# Altium schematic sheet VHF_AMP_top.SchDoc: =MainTitle
size 420 x 297 mm; SheetNumber: 1; SheetTotal: 9; EDA_Number: ARTIQ; Projet: ARTIQ/SINARA; ModifiedBy: -; CreateDate: XX/XX/XXXX; CheckedDate: -; Title2: Top entity; DivGrp: ISE; Designer: shanasz
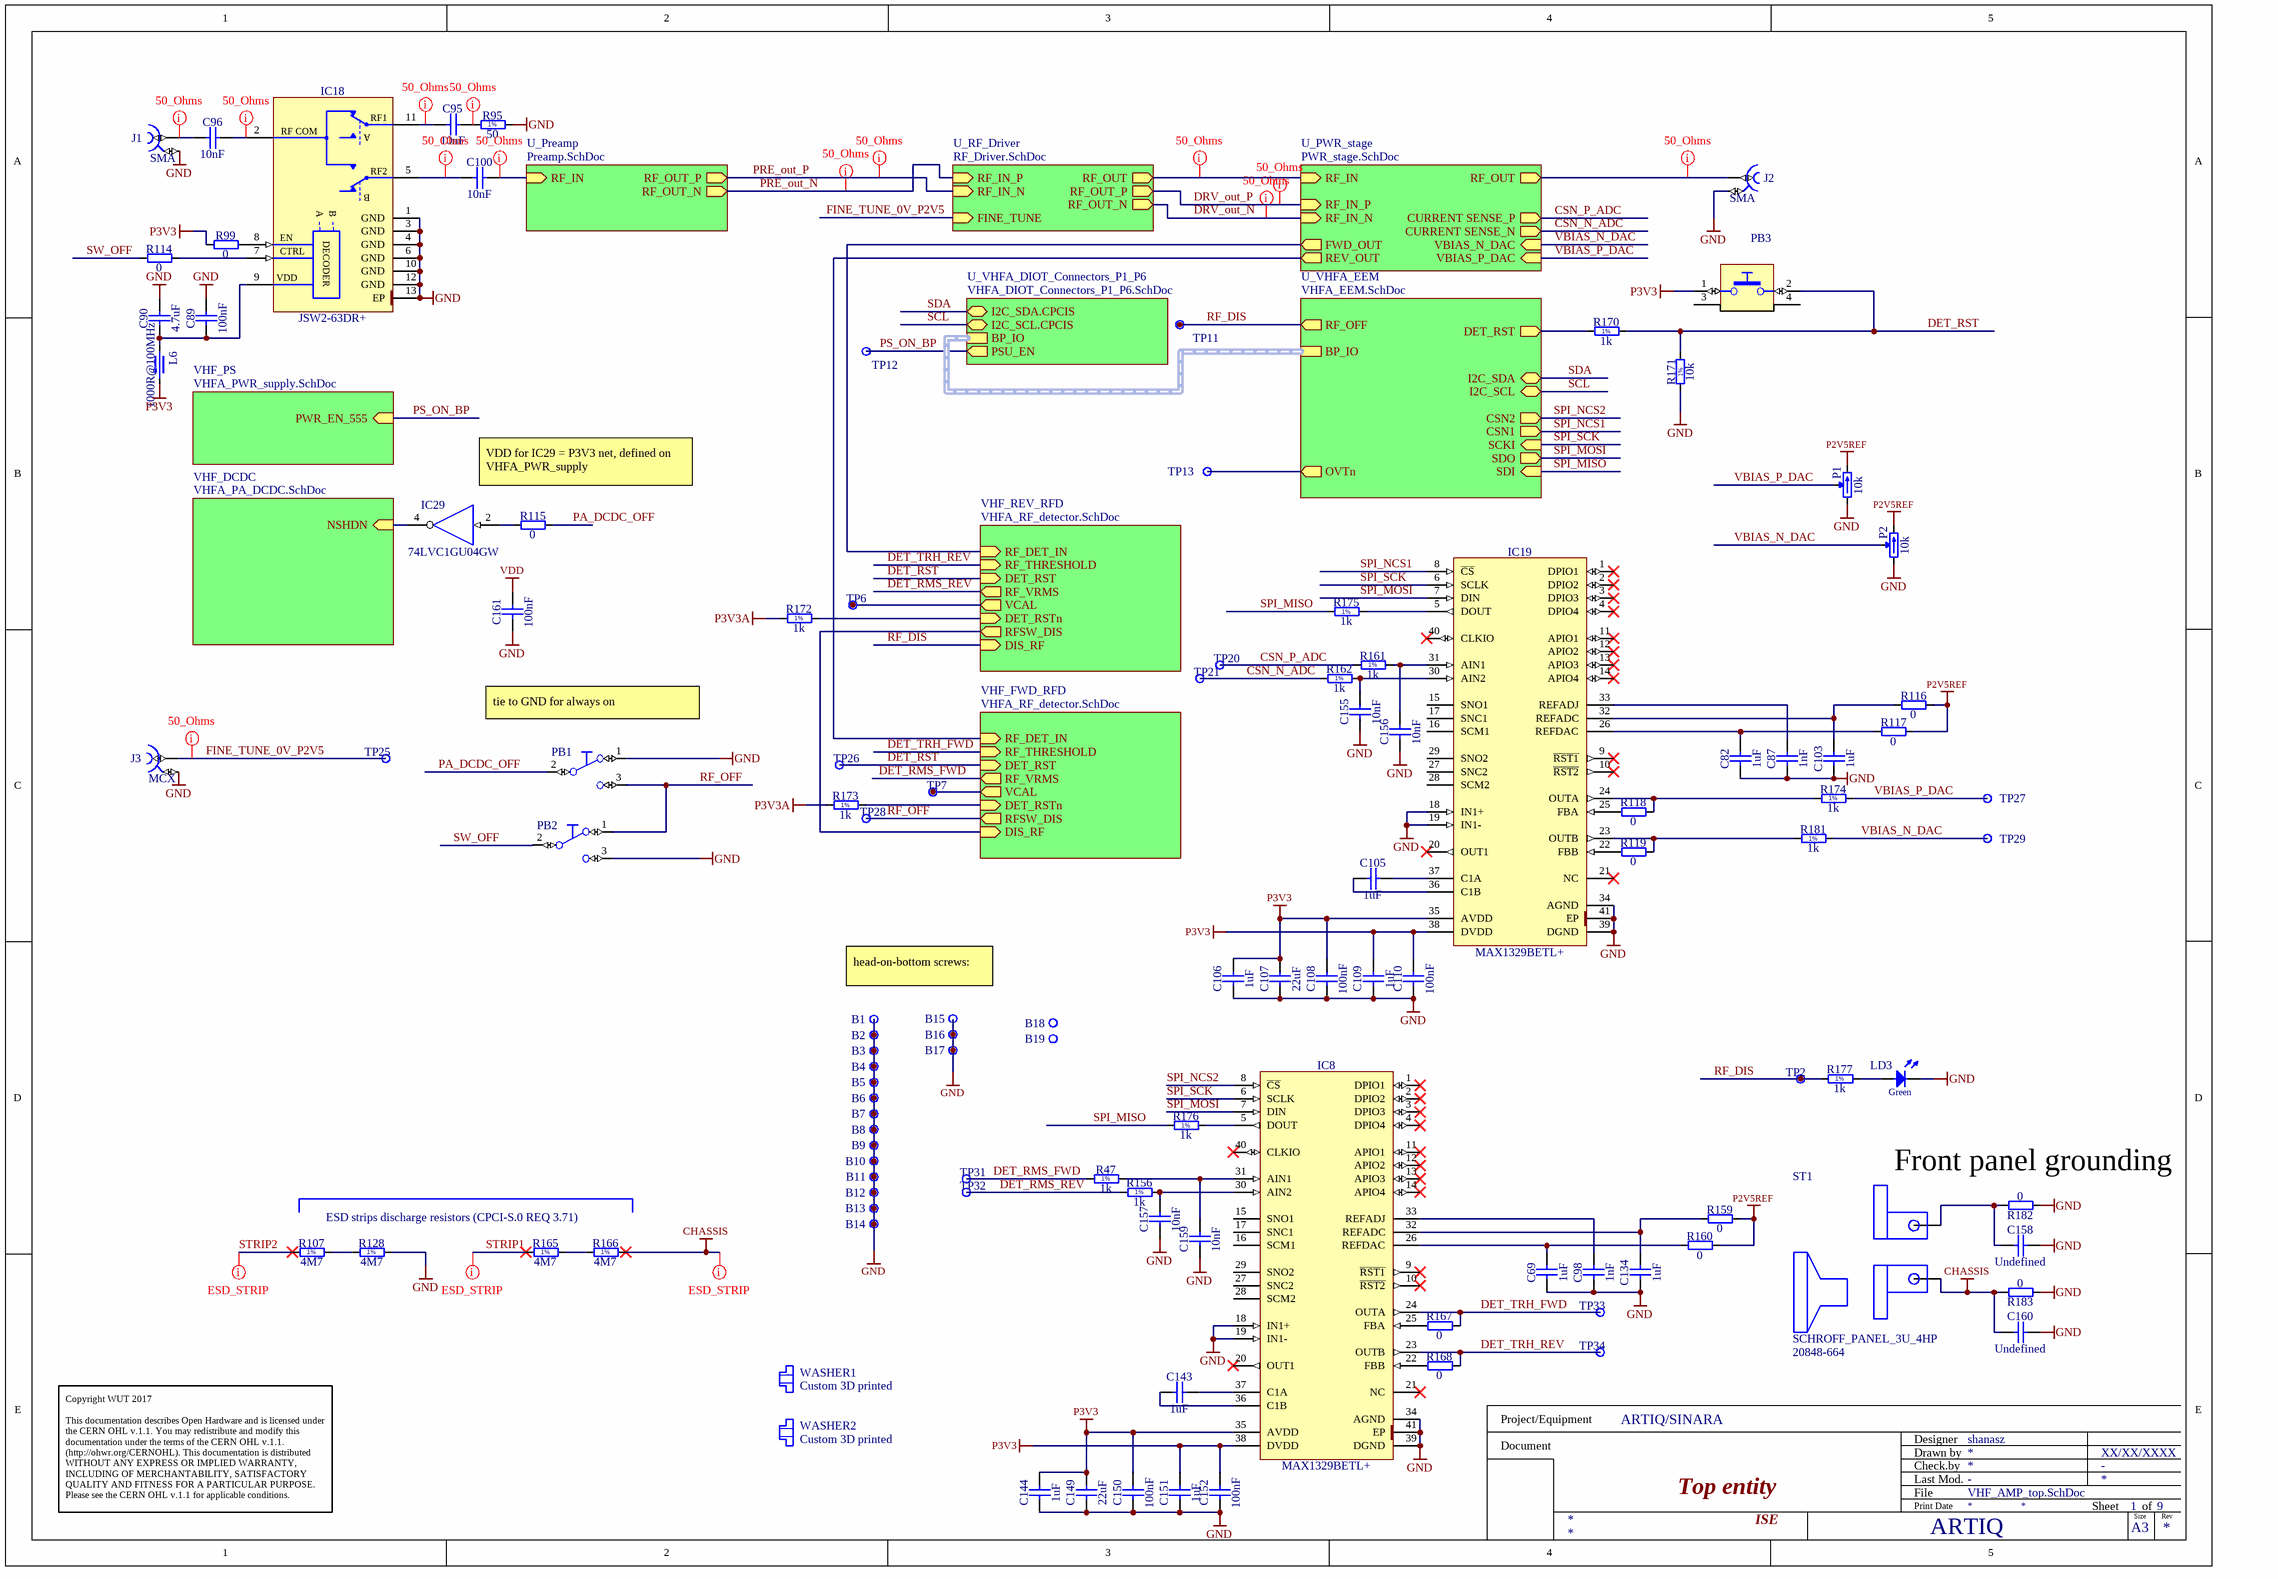
[diagram p0: VHF_AMP_top.SchDoc]

## Parts
B1  Plated Hole  [MTG320_550]  (value not drawn)  (no BOM)
B2  Plated Hole  [MTG320_550]  (value not drawn)  (no BOM)
B3  Plated Hole  [MTG320_550]  (value not drawn)  (no BOM)
B4  Plated Hole  [MTG320_550]  (value not drawn)  (no BOM)
B5  Plated Hole  [MTG320_550]  (value not drawn)  (no BOM)
B6  Plated Hole  [MTG320_550]  (value not drawn)  (no BOM)
B7  Plated Hole  [MTG320_550]  (value not drawn)  (no BOM)
B8  Plated Hole  [MTG320_550]  (value not drawn)  (no BOM)
B9  Plated Hole  [MTG320_550]  (value not drawn)  (no BOM)
B10  Plated Hole  [MTG320_550]  (value not drawn)  (no BOM)
B11  Plated Hole  [MTG320_550]  (value not drawn)  (no BOM)
B12  Plated Hole  [MTG320_550]  (value not drawn)  (no BOM)
B13  Plated Hole  [MTG320_550]  (value not drawn)  (no BOM)
B14  Plated Hole  [MTG320_550]  (value not drawn)  (no BOM)
B15  Plated Hole  [MTG320_550]  (value not drawn)  (no BOM)
B16  Plated Hole  [MTG320_550]  (value not drawn)  (no BOM)
B17  Plated Hole  [MTG320_550]  (value not drawn)  (no BOM)
B18  Plated Hole  [MTG320_550]  (value not drawn)  (no BOM)
B19  Plated Hole  [MTG320_550]  (value not drawn)  (no BOM)
C69  1uF  [CAPC1005X55N]
C82  1uF  [CAPC1005X55N]
C87  1nF  [CAPC2012X135N]
C89  100nF  [CAPC1005X55N]
C90  4.7uF  [CAPC1709X95N]
C95  10nF  [CAPC1608X87N]
C96  10nF  [CAPC1608X87N]
C98  1nF  [CAPC2012X135N]
C100  10nF  [CAPC1608X87N]
C103  1uF  [CAPC1005X55N]
C105  1uF  [CAPC1005X55N]
C106  1uF  [CAPC1005X55N]
C107  22uF  [CAPC3216X180N]
C108  100nF  [CAPC1005X55N]
C109  1uF  [CAPC1005X55N]
C110  100nF  [CAPC1005X55N]
C134  1uF  [CAPC1005X55N]
C143  1uF  [CAPC1005X55N]
C144  1uF  [CAPC1005X55N]
C149  22uF  [CAPC3216X180N]
C150  100nF  [CAPC1005X55N]
C151  1uF  [CAPC1005X55N]
C152  100nF  [CAPC1005X55N]
C155  10nF  [CAPC1608X87N]
C156  10nF  [CAPC1608X87N]
C157  10nF  [CAPC1608X87N]
C158  Undefined  [CAPC2012X135N]
C159  10nF  [CAPC1608X87N]
C160  Undefined  [CAPC2012X135N]
C161  100nF  [CAPC1005X55N]
IC8  MAX1329BETL+  [QFN50P600X600X80-41N-S425]
IC18  JSW2-63DR+  [MINI-CIRCUITS_MT1818]
IC19  MAX1329BETL+  [QFN50P600X600X80-41N-S425]
IC29  74LVC1GU04GW  [SOT65P212X110-5N]
J1  SMA  [DELOCK_65848]
J2  SMA  [DELOCK_65848]
J3  MCX  [AMPHENOL_919-383J-51A]
L6  1000R@100MHz  [INDC1608X95N]
LD3  Green  [LED_KINGBRIGHT_KPH-1608CGCK]
P1  10k  [TRIM_BOURNS_3224W]
P2  10k  [TRIM_BOURNS_3224W]
PB1  Switch  [SW_C&K_PCM12SMTR]  (value not drawn)
PB2  Switch  [SW_C&K_PCM12SMTR]  (value not drawn)
PB3  Push Button  [PB_TYCO_1-1825027-1]  (value not drawn)
R47  1k  [RESC1005X40N]
R95  50  [RESC1608X55N]
R99  0  [RESC1608X55N]
R107  4M7  [RESC2113X55N]
R114  0  [RESC1608X55N]
R115  0  [RESC1608X55N]
R116  0  [RESC1608X55N]
R117  0  [RESC1608X55N]
R118  0  [RESC1608X55N]
R119  0  [RESC1608X55N]
R128  4M7  [RESC2113X55N]
R156  1k  [RESC1005X40N]
R159  0  [RESC1608X55N]
R160  0  [RESC1608X55N]
R161  1k  [RESC1005X40N]
R162  1k  [RESC1005X40N]
R165  4M7  [RESC2113X55N]
R166  4M7  [RESC2113X55N]
R167  0  [RESC1608X55N]
R168  0  [RESC1608X55N]
R170  1k  [RESC1005X40N]
R171  10k  [RESC1005X40N]
R172  1k  [RESC1005X40N]
R173  1k  [RESC1005X40N]
R174  1k  [RESC1005X40N]
R175  1k  [RESC1005X40N]
R176  1k  [RESC1005X40N]
R177  1k  [RESC1005X40N]
R181  1k  [RESC1005X40N]
R182  0  [RESC1608X55N]
R183  0  [RESC1608X55N]
ST1  SCHROFF_PANEL_3U_4HP  Manufacturer Part Number 2: 20848-664  [SCHROFF_PANEL_3HP_4U]
TP2  Test Point  [TPS127]  (value not drawn)
TP6  Test Point  [TPS127]  (value not drawn)
TP7  Test Point  [TPS127]  (value not drawn)
TP11  Test Point  [TPS127]  (value not drawn)
TP12  Test Point  [TPS127]  (value not drawn)
TP13  Test Point  [NICOMATIC_C12000B]  (value not drawn)
TP20  Test Point  [TPS127]  (value not drawn)
TP21  Test Point  [TPS127]  (value not drawn)
TP25  Test Point  [TPS127]  (value not drawn)
TP26  Test Point  [TPS127]  (value not drawn)
TP27  Test Point  [TPS127]  (value not drawn)
TP28  Test Point  [TPS127]  (value not drawn)
TP29  Test Point  [TPS127]  (value not drawn)
TP31  Test Point  [TPS127]  (value not drawn)
TP32  Test Point  [TPS127]  (value not drawn)
TP33  Test Point  [TPS127]  (value not drawn)
TP34  Test Point  [TPS127]  (value not drawn)
WASHER1  Custom 3D printed  [Keystone_7687]
WASHER2  Custom 3D printed  [Keystone_7687]

## Sub-sheets
U_Preamp = Preamp.SchDoc: RF_IN (in), RF_OUT_N (out), RF_OUT_P (out)
U_PWR_stage = PWR_stage.SchDoc: RF_OUT (out), RF_IN (in), RF_IN_P (in), RF_IN_N (in), FWD_OUT (out), REV_OUT (out), CURRENT SENSE_P (out), CURRENT SENSE_N (out), VBIAS_N_DAC (in), VBIAS_P_DAC (in)
U_RF_Driver = RF_Driver.SchDoc: RF_OUT (out), RF_IN_P (in), RF_IN_N (in), RF_OUT_P (out), RF_OUT_N (out), FINE_TUNE (in)
U_VHFA_DIOT_Connectors_P1_P6 = VHFA_DIOT_Connectors_P1_P6.SchDoc: I2C_SDA.CPCIS (bidir), I2C_SCL.CPCIS (bidir), BP_IO (harness EEM_LVDS), PSU_EN (out)
U_VHFA_EEM = VHFA_EEM.SchDoc: I2C_SDA (bidir), I2C_SCL (bidir), OVTn (out), BP_IO (harness EEM_LVDS), RF_OFF (out), DET_RST (out), CSN1 (out), SCKI (in), SDO (out), SDI (in), CSN2 (out)
VHF_DCDC = VHFA_PA_DCDC.SchDoc: NSHDN (in)
VHF_FWD_RFD = VHFA_RF_detector.SchDoc: RF_DET_IN (in), RF_THRESHOLD (in), DET_RST (in), RF_VRMS (out), VCAL (out), DET_RSTn (in), RFSW_DIS (out), DIS_RF (in)
VHF_PS = VHFA_PWR_supply.SchDoc: PWR_EN_555 (in)
VHF_REV_RFD = VHFA_RF_detector.SchDoc: RF_DET_IN (in), RF_THRESHOLD (in), DET_RST (in), RF_VRMS (out), VCAL (out), DET_RSTn (in), RFSW_DIS (out), DIS_RF (in)

## Nets
CHASSIS: C160.1 R166.2 R183.2 ST1.0
GND: B1.1 B2.1 B3.1 B4.1 B5.1 B6.1 B7.1 B8.1 B9.1 B10.1 B11.1 B12.1 B13.1 B14.1 B16.1 B17.1 C69.1 C82.1 C87.1 C89.1 C90.1 C98.1 C103.1 C106.1 C107.1 C108.1 C109.1 C110.1 C134.1 C144.1 C149.1 C150.1 C151.1 C152.1 C155.1 C156.1 C157.1 C158.2 C159.1 C160.2 C161.1 IC8.18(IN1+) IC8.19(IN1-) IC8.34(AGND) IC8.39(DGND) IC8.41(EP) IC18.1(GND) IC18.3(GND) IC18.4(GND) IC18.6(GND) IC18.10(GND) IC18.12(GND) IC18.13(EP) IC19.18(IN1+) IC19.19(IN1-) IC19.34(AGND) IC19.39(DGND) IC19.41(EP) IC29.3(GND) J1.2 J2.2 J3.2 LD3.1(C) P1.1(CCW) P2.1(CCW) PB1.1 PB2.3 R95.2 R128.2 R171.1 R182.1 R183.1
P2V5REF: P1.3(CW) P2.3(CW) R116.2 R117.2 R159.2 R160.2
P3V3: C106.2 C107.2 C108.2 C109.2 C110.2 C144.2 C149.2 C150.2 C151.2 C152.2 IC8.35(AVDD) IC8.38(DVDD) IC19.35(AVDD) IC19.38(DVDD) L6.2 PB3.1 R99.1
P3V3A: R172.1 R173.1
VDD: C161.2 IC29.5(VCC)
CSN_N_ADC: R162.1 TP21.1 ; sheet U_PWR_stage/CURRENT SENSE_N
CSN_P_ADC: R161.1 TP20.1 ; sheet U_PWR_stage/CURRENT SENSE_P
DET_RMS_FWD: R47.1 TP31.1 ; sheet VHF_FWD_RFD/RF_VRMS
DET_RMS_REV: R156.1 TP32.1 ; sheet VHF_REV_RFD/RF_VRMS
DET_RST: PB3.2 R170.2 R171.2 TP26.1 ; sheet VHF_REV_RFD/DET_RST, sheet VHF_FWD_RFD/DET_RST
DET_TRH_FWD: IC8.24(OUTA) R167.2 TP33.1 ; sheet VHF_FWD_RFD/RF_THRESHOLD
DET_TRH_REV: IC8.23(OUTB) R168.2 TP34.1 ; sheet VHF_REV_RFD/RF_THRESHOLD
DRV_out_N: sheet U_PWR_stage/RF_IN_N, sheet U_RF_Driver/RF_OUT_N
DRV_out_P: sheet U_PWR_stage/RF_IN_P, sheet U_RF_Driver/RF_OUT_P
FINE_TUNE_0V_P2V5: J3.1 TP25.1 ; sheet U_RF_Driver/FINE_TUNE
PA_DCDC_OFF: PB1.2 R115.2
PRE_out_N: sheet U_Preamp/RF_OUT_N, sheet U_RF_Driver/RF_IN_P
PRE_out_P: sheet U_Preamp/RF_OUT_P, sheet U_RF_Driver/RF_IN_N
PS_ON_BP: TP12.1 ; sheet U_VHFA_DIOT_Connectors_P1_P6/PSU_EN, sheet VHF_PS/PWR_EN_555
RF_DIS: R177.1 TP2.1 TP11.1 ; sheet U_VHFA_EEM/RF_OFF, sheet VHF_REV_RFD/DIS_RF
RF_OFF: PB1.3 PB2.1 TP28.1 ; sheet VHF_FWD_RFD/RFSW_DIS
SCL: sheet U_VHFA_DIOT_Connectors_P1_P6/I2C_SCL.CPCIS, sheet U_VHFA_EEM/I2C_SCL
SDA: sheet U_VHFA_DIOT_Connectors_P1_P6/I2C_SDA.CPCIS, sheet U_VHFA_EEM/I2C_SDA
SPI_MISO: R175.1 R176.1 ; sheet U_VHFA_EEM/SDI
SPI_MOSI: IC8.7(DIN) IC19.7(DIN) ; sheet U_VHFA_EEM/SDO
SPI_NCS1: IC19.8(~{CS}) ; sheet U_VHFA_EEM/CSN1
SPI_NCS2: IC8.8(~{CS}) ; sheet U_VHFA_EEM/CSN2
SPI_SCK: IC8.6(SCLK) IC19.6(SCLK) ; sheet U_VHFA_EEM/SCKI
STRIP1: R165.1
STRIP2: R107.1
SW_OFF: PB2.2 R114.1
VBIAS_N_DAC: P2.2(W) R181.2 TP29.1 ; sheet U_PWR_stage/VBIAS_N_DAC
VBIAS_P_DAC: P1.2(W) R174.2 TP27.1 ; sheet U_PWR_stage/VBIAS_P_DAC
NetC69_2: C69.2 IC8.26(REFDAC) R160.1
NetC82_2: C82.2 IC19.26(REFDAC) R117.1
NetC87_2: C87.2 IC19.33(REFADJ)
NetC89_2: C89.2 C90.2 IC18.9(VDD) L6.1
NetC95_1: C95.1 IC18.11(RF1)
NetC95_2: C95.2 R95.1
NetC96_1: C96.1 J1.1
NetC96_2: C96.2 IC18.2(RF_COM)
NetC98_2: C98.2 IC8.33(REFADJ)
NetC100_1: C100.1 IC18.5(RF2)
NetC100_2: C100.2 ; sheet U_Preamp/RF_IN
NetC103_2: C103.2 IC19.32(REFADC) R116.1
NetC105_1: C105.1 IC19.36(C1B)
NetC105_2: C105.2 IC19.37(C1A)
NetC134_2: C134.2 IC8.32(REFADC) R159.1
NetC143_1: C143.1 IC8.36(C1B)
NetC143_2: C143.2 IC8.37(C1A)
NetC155_2: C155.2 IC19.30(AIN2) R162.2
NetC156_2: C156.2 IC19.31(AIN1) R161.2
NetC157_2: C157.2 IC8.30(AIN2) R156.2
NetC158_1: C158.1 R182.2 ST1.1
NetC159_2: C159.2 IC8.31(AIN1) R47.2
NetIC8_5: IC8.5(DOUT) R176.2
NetIC8_22: IC8.22(FBB) R168.1
NetIC8_25: IC8.25(FBA) R167.1
NetIC18_7: IC18.7(CTRL) R114.2
NetIC18_8: IC18.8(EN) R99.2
NetIC19_5: IC19.5(DOUT) R175.2
NetIC19_22: IC19.22(FBB) R119.1
NetIC19_23: IC19.23(OUTB) R119.2 R181.1
NetIC19_24: IC19.24(OUTA) R118.2 R174.1
NetIC19_25: IC19.25(FBA) R118.1
NetIC29_2: IC29.2(IN) R115.1
NetIC29_4: IC29.4(OUT) ; sheet VHF_DCDC/NSHDN
NetJ2_1: J2.1 ; sheet U_PWR_stage/RF_OUT
NetLD3_2: LD3.2(A) R177.2
NetR107_2: R107.2 R128.1
NetR165_2: R165.2 R166.1
NetR170_1: R170.1 ; sheet U_VHFA_EEM/DET_RST
NetR172_2: R172.2 ; sheet VHF_REV_RFD/DET_RSTn
NetR173_2: R173.2 ; sheet VHF_FWD_RFD/DET_RSTn
NetTP6_1: TP6.1 ; sheet VHF_REV_RFD/VCAL
NetTP7_1: TP7.1 ; sheet VHF_FWD_RFD/VCAL
NetTP13_1: TP13.1 ; sheet U_VHFA_EEM/OVTn
(unnamed): sheet U_PWR_stage/RF_IN, sheet U_RF_Driver/RF_OUT
(unnamed): sheet U_PWR_stage/FWD_OUT, sheet VHF_REV_RFD/RF_DET_IN
(unnamed): sheet U_PWR_stage/REV_OUT, sheet VHF_FWD_RFD/RF_DET_IN
(unnamed): sheet VHF_REV_RFD/RFSW_DIS, sheet VHF_FWD_RFD/DIS_RF

Not connected (* = marked no-connect by the designer): B15 1; B18 1; B19 1; IC8 1(DPIO1)* 2(DPIO2)* 3(DPIO3)* 4(DPIO4)* 9(~{RST1})* 10(~{RST2})* 11(APIO1)* 12(APIO2)* 13(APIO3)* 14(APIO4)* 15(SNO1) 16(SCM1) 17(SNC1) 20(OUT1)* 21(NC)* 27(SNC2) 28(SCM2) 29(SNO2) 40(CLKIO)*; IC19 1(DPIO1)* 2(DPIO2)* 3(DPIO3)* 4(DPIO4)* 9(~{RST1})* 10(~{RST2})* 11(APIO1)* 12(APIO2)* 13(APIO3)* 14(APIO4)* 15(SNO1) 16(SCM1) 17(SNC1) 20(OUT1)* 21(NC)* 27(SNC2) 28(SCM2) 29(SNO2) 40(CLKIO)*; PB3 3 4

## Buses and harness runs
harness sheet U_VHFA_DIOT_Connectors_P1_P6/BP_IO = sheet U_VHFA_EEM/BP_IO

## Layout directives
net class 50_Ohms: (no net found under the mark), DRV_out_N, DRV_out_P, FINE_TUNE_0V_P2V5, NetC95_1, NetC95_2, NetC96_1, NetC96_2, NetC100_1, NetC100_2, NetJ2_1, PRE_out_N, PRE_out_P
net class ESD_STRIP: CHASSIS, STRIP1, STRIP2

## Notes on the sheet
- VDD for IC29 = P3V3 net, defined on VHFA_PWR_supply
- (near PB1) tie to GND for always on
- head-on-bottom screws:
- (near R182) Front panel grounding
- ESD strips discharge resistors (CPCI-S.0 REQ 3.71)
- Project/Equipment
- Document
- Designer
- Drawn by
- Check.by
- Copyright WUT 2017
  This documentation describes Open Hardware and is licensed under the CERN OHL v.1.1. You may redistribute and modify this documentation under the terms of the CERN OHL v.1.1. (http://ohwr.org/CERNOHL). This documentation is distributed WITHOUT ANY EXPRESS OR IMPLIED WARRANTY, INCLUDING OF MERCHANTABILITY, SATISFACTORY QUALITY AND FITNESS FOR A PARTICULAR PURPOSE. Please see the CERN OHL v.1.1 for applicable conditions.
- File
- Last Mod.
- Print Date
- Sheet
- Size
- A3
- of
- Rev
- (in symbol JSW2-63DR+) A; B; DECODER
- (in symbol R0402_1K_1%_0.0625W_100PPM) 1%
- (in symbol R0402_10K_1%_0.0625W_100PPM) 1%
- (in symbol R0603_50R_1%_0.1W_100PPM) 1%
- (in symbol R0805_4M7_1%_0.125W_100PPM_VISHAY_CRCW e3) 1%

## Library data of the parts
B1-B19 = PLATED_HOLE3.2_PAD5.5: Single Terminal Socket; Part Description: Plated Through Hole: Hole Dia.=3.2mm Pad Dia.=5.5mm; Mounted: No; Part Number: PLATED_HOLE3.2_PAD5.5; Component Type: Standard (No BOM); Pin Count: 1; Family: Plated Hole; Socket: No; SMD: No; Sense: No; Status: None; ComponentHeight: 0mm; HelpURL: Undefined; Author: CERN DEM JMW; CreateDate: 01.10.2012; LatestRevisionDate: 01.10.2012; PackageDescription: Plated Through Hole: Hole Dia.=3.2mm Pad Dia.=5.5mm
C69 C82 C103 C105 C106 C109 C134 C143 C144 C151 = CC0402_1UF_16V_10%_X5R: Non-polarised capacitor; Part Description: SMD Multilayer Chip Ceramic Capacitor; Manufacturer: GENERIC; Manufacturer1 Part Number: C1005X5R1C105KT; Voltage: 16V; TC: X5R; Tolerance: ±10%; Part Number: CC0402_1UF_16V_10%_X5R; Component Kind: Standard; Component Type: Standard; Pin Count: 2; Value: 1uF; Status: Preferred; Manufacturer Part Number: CC0402_1UF_16V_10%_X5R; Case: 0402; Mounted: Yes; Socket: No; SMD: Yes; Sense: No; Manufacturer1 Example: TDK; Manufacturer1 ComponentHeight: 0.55mm; HelpURL: \\cern.ch\dfs\Applications\Altium\Datasheets\CC0402_X5R_TDK_C.pdf; Author: CERN DEM JLC; CreateDate: 2012-10-25; LatestRevisionDate: 2012-10-25
C87 C98 = CC0805_1NF_50V_5%_C0G: Non-polarised capacitor; Part Description: SMD Multilayer Chip Ceramic Capacitor; Manufacturer: GENERIC; Manufacturer1 Part Number: C0805C102J5GACTU; Voltage: 50V; TC: C0G/NP0; Tolerance: ±5%; Part Number: CC0805_1NF_50V_5%_C0G; Component Kind: Standard; Component Type: Standard; Pin Count: 2; Value: 1nF; Status: None; Manufacturer Part Number: CC0805_1NF_50V_5%_C0G; Case: 0805; Mounted: Yes; Socket: No; SMD: Yes; Sense: No; Manufacturer1 Example: KEMET; Manufacturer1 ComponentHeight: 0.88mm; HelpURL: \\cern.ch\dfs\Applications\Altium\Datasheets\CC0805_C0G_KEMET_(Commercial Grade).pdf; Author: CERN DEM JLC; CreateDate: 02.02.2011; LatestRevisionDate: 22.04.2015
C89 = CC0402_100NF_16V_10%_X5R: Non-polarised capacitor; Manufacturer: GENERIC; Part Description: SMD Multilayer Chip Ceramic Capacitor; Manufacturer1 Part Number: GRM155R61C104KA88D; Voltage: 16V; TC: X5R; Tolerance: ±10%; Value: 100nF; Manufacturer Part Number: CC0402_100NF_16V_10%_X5R; Part Number: CC0402_100NF_16V_10%_X5R; Component Kind: Standard; Component Type: Standard; Pin Count: 2; Status: None; Case: 0402; Mounted: Yes; Socket: No; SMD: Yes; Sense: No; Manufacturer1 Example: MURATA; Manufacturer1 ComponentHeight: 0.55mm; HelpURL: \\cern.ch\dfs\Applications\Altium\Datasheets\CC0402_X5R_MURATA_GRM.pdf; Author: CERN DEM JLC; CreateDate: 10.12.2013; LatestRevisionDate: 10.12.2013
C90 = CC0603_4.7UF_16V_10%_X5R: Non-polarised capacitor; Manufacturer: GENERIC; Part Description: SMD Multilayer Chip Ceramic Capacitor; Manufacturer1 Part Number: EMK107ABJ475KA-T; Voltage: 16V; TC: X5R; Tolerance: ±10%; Value: 4.7uF; Manufacturer Part Number: CC0603_4.7UF_16V_10%_X5R; Part Number: CC0603_4.7UF_16V_10%_X5R; Component Kind: Standard; Component Type: Standard; Pin Count: 2; Status: None; Case: 0603; Mounted: Yes; Socket: No; SMD: Yes; Sense: No; Manufacturer1 Example: TAIYO YUDEN; Manufacturer1 ComponentHeight: 0.95mm; HelpURL: \\cern.ch\dfs\Applications\Altium\Datasheets\CC0603_X7R_TAIYO-YUDEN_HIGH-VALUE.pdf; Author: CERN DEM JLC; CreateDate: 16.12.2013; LatestRevisionDate: 16.09.2014
C95 C96 C100 C155-C157 C159 = CC0603_10NF_50V_10%_X7R: Non-polarised capacitor; Part Description: SMD Multilayer Chip Ceramic Capacitor; Manufacturer: GENERIC; Manufacturer1 Part Number: 223858615636; Voltage: 50V; TC: X7R; Tolerance: ±10%; Part Number: CC0603_10NF_50V_10%_X7R; Component Kind: Standard; Component Type: Standard; Pin Count: 2; Value: 10nF; Status: Preferred; Manufacturer Part Number: CC0603_10NF_50V_10%_X7R; Case: 0603; Mounted: Yes; Socket: No; SMD: Yes; Sense: No; Manufacturer1 Example: PHYCOMP; Manufacturer1 ComponentHeight: 0.87mm; HelpURL: \\cern.ch\dfs\Applications\Altium\Datasheets\CC0603_X7R_PHYCOMP.pdf; Author: CERN DEM JLC; CreateDate: 03.12.2007; LatestRevisionDate: 03.12.2007
C107 C149 = CC1206_22UF_35V_20%_JB_TDK_C3216JB1V226M160AC: Non-polarised capacitor; Part Description: SMD Multilayer Chip Ceramic Capacitor; Manufacturer: TDK; Voltage: 35V; TC: JB(±10%); Tolerance: ±20%; Part Number: CC1206_22UF_35V_20%_JB_TDK_C3216JB1V226M160AC; Component Kind: Standard; Component Type: Standard; Pin Count: 2; Value: 22uF; Status: None; Manufacturer Part Number: C3216JB1V226M160AC; Case: 1206; Mounted: Yes; Socket: No; SMD: Yes; Sense: No; HelpURL: \\cern.ch\dfs\Applications\Altium\Datasheets\CC1206_TDK_C3216JB1V226M160AC.pdf; Author: CERN DEM JLC; CreateDate: 13.07.2017; LatestRevisionDate: 13.07.2017; ComponentHeight: 1.8mm
C108 C110 C150 C152 C161 = CC0402_100NF_16V_10%_X5R: Non-polarised capacitor; Part Description: SMD Multilayer Chip Ceramic Capacitor; Manufacturer: GENERIC; Manufacturer1 Part Number: GRM155R61C104KA88D; Voltage: 16V; TC: X5R; Tolerance: ±10%; Part Number: CC0402_100NF_16V_10%_X5R; Component Kind: Standard; Component Type: Standard; Pin Count: 2; Value: 100nF; Status: None; Manufacturer Part Number: CC0402_100NF_16V_10%_X5R; Case: 0402; Mounted: Yes; Socket: No; SMD: Yes; Sense: No; Manufacturer1 Example: MURATA; Manufacturer1 ComponentHeight: 0.55mm; HelpURL: \\cern.ch\dfs\Applications\Altium\Datasheets\CC0402_X5R_MURATA_GRM.pdf; Author: CERN DEM JLC; CreateDate: 10.12.2013; LatestRevisionDate: 10.12.2013
C158 C160 = CC0805_NO-VALUE: Non-polarised capacitor; Part Description: Reserved Footprint For 0805(2012) Chip Ceramic Capacitor; Mounted: No; Part Number: CC0805_NO-VALUE; Component Kind: Standard; Component Type: Standard; Pin Count: 2; Value: Undefined; Status: None; Manufacturer: Undefined; Manufacturer Part Number: CC0805_NO-VALUE; Case: 0805; Socket: No; SMD: Yes; Sense: No; Manufacturer1 ComponentHeight: 1.35mm; HelpURL: Undefined; Author: CERN DEM JLC; CreateDate: 10.12.2008; LatestRevisionDate: 11.09.2013
IC8 IC19 = MAX1329BETL+: 12-/16-Bit DAS with ADC, DACs, DPIOs, APIOs, Reference, Voltage Monitors, and Temp Sensor; Manufacturer: MAXIM; PressFit: No; Bonding: No; Part Number: MAX1329BETL+; Component Kind: Standard; Component Type: Standard; Device: MAX1329BETL+; PackageDescription: QFN, 0.50mm Pitch, Square; 40 Pin, 6.00mm L X 6.00mm W X 0.80mm H body (w/Thermal Tab 4.25 X 4.25mm), IPC Medium Density; Part Description: 12-/16-Bit DAS with ADC, DACs, DPIOs, APIOs, Reference, Voltage Monitors, and Temp Sensor; Manufacturer Part Number: MAX1329BETL; Pin Count: 41; Case: QFN40; Mounted: Yes; Socket: No; SMD: Yes; Sense: No; ComponentHeight: 0.8mm; Author: CERN DEM HF; HelpURL: \\cern.ch\dfs\Applications\Altium\Datasheets\MAX1329BETL+.pdf; CreateDate: 09.02.2022; LatestRevisionDate: 04.04.2022
IC18 = JSW2-63DR+: SPDT RF Switch, 50 Ohm, 5 to 6000MHz, High Power 3W; Part Description: SPDT RF Switch, 50 Ohms, 5 to 6000MHz, High Power 3W; Manufacturer: MINI-CIRCUITS; PressFit: No; Bonding: No; Part Number: JSW2-63DR+; Component Kind: Standard; Component Type: Standard; Device: JSW2-63DR+; PackageDescription: MINI-CIRCUITS MT1818 Case, Body 2.06mm L X 2.06mm W X 0.61mm H; Manufacturer Part Number: JSW2-63DR+; Pin Count: 13; Mounted: Yes; Socket: No; SMD: Yes; Sense: No; ComponentHeight: 0.61mm; Author: CERN DEM JMW; HelpURL: \\cern.ch\dfs\Applications\Altium\Datasheets\JSW2-63DR+.pdf; CreateDate: 11.08.2016; LatestRevisionDate: 11.08.2016
IC29 = 74LVC1GU04GW: Single Inverter Buffer; Manufacturer: NXP SEMICONDUCTORS; PressFit: No; Bonding: No; Part Number: 74LVC1GU04GW; Component Kind: Standard; Component Type: Standard; Device: 74LVC1GU04GW; PackageDescription: SOT353, SOT, 0.65mm Pitch, 5 pin, 1.25mm W X 2.05mm L X 1.10mm H, IPC Medium Density; Part Description: Inverter; Manufacturer Part Number: 74LVC1GU04GW; Pin Count: 3; Case: SOT353; Mounted: Yes; Socket: No; SMD: Yes; Sense: No; ComponentHeight: 1.1mm; Author: CERN DEM JLC; HelpURL: \\cern.ch\dfs\Applications\Altium\Datasheets\74LVC1GU04GW.pdf; CreateDate: 11.01.2011; LatestRevisionDate: 11.01.2011
J1 J2 = CON_SMA_DELOCK_65848: 50 Ohm Through Hole SMA Right Angle PCB Jack; Manufacturer: DELOCK; Manufacturer Part Number: 5848 (4043619658480); PressFit: No; Part Number: DELOCK_65848; Component Kind: Standard; Component Type: Standard; Pin Count: 5; Family: SMA; Mounted: Yes; Socket: No; SMD: No; Sense: No; Status: None; Part Description: 50 Ohm Through Hole SMA Right Angle PCB Jack; ComponentHeight: 12.5; HelpURL: \\cern.ch\dfs\Applications\Altium\Datasheets\AMPHENOL_132203-16.pdf; Author: GK; CreateDate: 13.05.2019; LatestRevisionDate: 13.05.2019
J3 = AMPHENOL_919-383J-51A: Part Description: 50 Ohm, RF Connector, MCX Right Angle PCB Receptacle Jack; PressFit: No; Part Number: AMPHENOL_919-383J-51A; Component Kind: Standard; Component Type: Standard; Pin Count: 5; Family: MCX; Mounted: Yes; Socket: No; SMD: No; Sense: No; Status: None; Manufacturer: AMPHENOL; Manufacturer Part Number: 919-383J-51A; ComponentHeight: 6mm; HelpURL: \\cern.ch\dfs\Applications\Altium\Datasheets\AMPHENOL_919-383J-51A.pdf; Author: CERN DEM BC; CreateDate: 31.01.2019; LatestRevisionDate: 31.01.2019
L6 = IND0603_MURATA_BLM18HE102SN1: Manufacturer: MURATA; Part Description: SMD EMIFIL Suppression Chip Ferrite Bead; Power: 600mA; Resistance: 0.35R; Tolerance: ±25%; Value: 1000R@100MHz; Manufacturer Part Number: BLM18HE102SN1; Part Number: IND0603_MURATA_BLM18HE102SN1; Component Kind: Standard; Component Type: Standard; Pin Count: 2; Status: None; Case: 0603; Mounted: Yes; Socket: No; SMD: Yes; Sense: No; ComponentHeight: 0.95mm; HelpURL: \\cern.ch\dfs\Applications\Altium\Datasheets\IND0603_MURATA_BLM18H.pdf; Author: CERN DEM JLC; CreateDate: 09.12.2013; LatestRevisionDate: 25.10.2018
LD3 = LED_KINGBRIGHT_KPH-1608CGCK: LED Green 1C 2A; Part Description: SMD Green LED, Case 1.6mmX0.8mm(0603), 0.65mm Thickness; PressFit: No; Bonding: No; Part Number: LED_KINGBRIGHT_KPH-1608CGCK; Component Kind: Standard; Component Type: Standard; Color: Green; PackageDescription: SMT Green LED, Case 0603, Body L 1.6 x W 0.8mm H 0.65mm; Manufacturer: KINGBRIGHT; Manufacturer Part Number: KPH-1608CGCK; Pin Count: 2; Mounted: Yes; Socket: No; SMD: Yes; Sense: No; ComponentHeight: 0.65mm; HelpURL: \\cern.ch\dfs\Applications\Altium\Datasheets\LED_KINGBRIGHT_KPH-1608CGCK.pdf; Author: CERN DEM JLC; CreateDate: 03.07.2017; LatestRevisionDate: 03.07.2017
P1 P2 = TRIM_12T_10K_BOURNS_3224W-1-103E: Trimming Potentiometer; Part Description: 12 Turns SMD Trimpot® Trimming Potentiometer (Top Adjust); Manufacturer: BOURNS; Power: 0.25W; TC: ±100ppm/°C; Tolerance: ±10%; PressFit: No; Part Number: TRIM_12T_10K_BOURNS_3224W-1-103E; Component Kind: Standard; Component Type: Standard; Pin Count: 3; Value: 10k; Manufacturer Part Number: 3224W-1-103E; Case: 3224W; Mounted: Yes; Socket: No; SMD: Yes; Sense: No; ComponentHeight: 5.3mm; HelpURL: \\cern.ch\dfs\Applications\Altium\Datasheets\TRIM_BOURNS_3224W.pdf; Author: CERN DEM JLC; CreateDate: 18.12.2012; LatestRevisionDate: 18.12.2012
PB1 PB2 = SW_C&K_PCM12SMTR: Push-Button Switch SPDT; Part Description: SPDT, Right Angled Ultraminiature Surface Mount Slide Switches, C&K PCM Series; Manufacturer: C&K; PressFit: No; Sense Comment: Non-washable; Part Number: SW_C&K_PCM12SMTR; Component Kind: Standard; Component Type: Standard; Pin Count: 7; PackageDescription: SPDT, Right Angled Ultraminiature Surface Mount Slide Switches, C&K PCM Series; Family: Switch; Mounted: Yes; Socket: No; SMD: Yes; Sense: Yes; Status: None; Manufacturer Part Number: PCM12SMTR; ComponentHeight: 1.4mm; HelpURL: \\cern.ch\dfs\Applications\Altium\Datasheets\SW_C&K_PCM12SMTR.pdf; Author: CERN DEM JLC; CreateDate: 11.07.2018; LatestRevisionDate: 11.07.2018
PB3 = PB_TYCO_1-1825027-1: Push-Button Switch SPDT; Part Description: Right Angle Micro Miniature Tactile Pushbutton Switch, Round Actuator Length = 5.74mm, FSMRAJ Series; Manufacturer: TYCO ELECTRONICS; PressFit: No; Part Number: PB_TYCO_1-1825027-1; Component Kind: Standard; Component Type: Standard; Pin Count: 4; PackageDescription: Right Angle Micro Miniature Tactile Pushbutton Switch, Round Actuator Length = 5.74mm, FSMRAJ Serie; Family: Push Button; Mounted: Yes; Socket: No; SMD: No; Sense: No; Status: None; Manufacturer Part Number: 1-1825027-1; ComponentHeight: 7.01mm; HelpURL: \\cern.ch\dfs\Applications\Altium\Datasheets\PB_TYCO_1-1825027-1.pdf; Author: CERN DEM JLC; CreateDate: 17.04.2013; LatestRevisionDate: 28.10.2013
R47 R156 R161 R162 R170 R172-R177 R181 = R0402_1K_1%_0.0625W_100PPM: Resistor - 1%; Part Description: General Purpose Thick Film Chip Resistor; Manufacturer: GENERIC; Manufacturer1 Part Number: 232270671002L; TC: ±100ppm/°C; PressFit: No; Part Number: R0402_1K_1%_0.0625W_100PPM; Component Kind: Standard; Component Type: Standard; Pin Count: 2; Value: 1k; Status: Not Recommended; Power: 0.0625W; Tolerance: ±1%; Manufacturer Part Number: R0402_1K_1%_0.0625W_100PPM; Case: 0402; Mounted: Yes; Sense: No; Socket: No; SMD: Yes; Manufacturer1 Example: YAGEO PHYCOMP; Manufacturer1 ComponentHeight: 0.4mm; HelpURL: \\cern.ch\dfs\Applications\Altium\Datasheets\R0402_Phycomp_RC0402.pdf; Author: CERN DEM JLC; CreateDate: 03.12.2007; LatestRevisionDate: 17.10.2012
R95 = R0603_50R_1%_0.1W_100PPM: Resistor - 1%; Part Description: General Purpose Thick Film Chip Resistor; Manufacturer: GENERIC; Manufacturer1 Part Number: CRCW060350R0FKEA; Power: 0.1W; TC: ±100ppm/°C; PressFit: No; Part Number: R0603_50R_1%_0.1W_100PPM; Component Kind: Standard; Component Type: Standard; Pin Count: 2; Value: 50; Status: Preferred; Tolerance: ±1%; Manufacturer Part Number: R0603_50R_1%_0.1W_100PPM; Case: 0603; Mounted: Yes; Sense: No; Socket: No; SMD: Yes; Manufacturer1 Example: VISHAY; Manufacturer1 ComponentHeight: 0.50mm; HelpURL: \\cern.ch\dfs\Applications\Altium\Datasheets\R0603_VISHAY_CRCW e3.pdf; Author: CERN DEM MR; CreateDate: 08.09.2017; LatestRevisionDate: 08.09.2017
R99 R114-R119 R159 R160 R167 R168 R182 R183 = R0603_0R_JUMPER: Resistor; Part Description: 1A (0.05R Max DC Resistance) Zero Ohm Jumper; Manufacturer: GENERIC; Manufacturer1 Part Number: NRC06Z0; PressFit: No; Part Number: R0603_0R_JUMPER; Component Kind: Standard; Component Type: Standard; Pin Count: 2; Value: 0; Status: Preferred; Manufacturer Part Number: R0603_0R_JUMPER; Case: 0603; Mounted: Yes; Sense: No; Socket: No; SMD: Yes; Manufacturer1 Example: NIC COMPONENT; Manufacturer1 ComponentHeight: 0.55mm; HelpURL: \\cern.ch\dfs\Applications\Altium\Datasheets\R0603_NIC_NRC.pdf; Author: CERN DEM JLC; CreateDate: 03.12.2007; LatestRevisionDate: 13.03.2008
R107 R128 R165 R166 = R0805_4M7_1%_0.125W_100PPM_VISHAY_CRCW e3: Resistor - 1%; Part Description: 150V, Standard Thick Film Chip Resistor; Manufacturer: VISHAY; Manufacturer Part Number: CRCW08054M70FKEA; Power: 0.125W; TC: ±100ppm/°C; PressFit: No; Part Number: R0805_4M7_1%_0.125W_100PPM_VISHAY_CRCW e3; Component Kind: Standard; Component Type: Standard; Pin Count: 2; Value: 4M7; Status: None; Tolerance: ±1%; Case: 0805; Mounted: Yes; Sense: No; Socket: No; SMD: Yes; ComponentHeight: 0.5mm; HelpURL: \\cern.ch\dfs\Applications\Altium\Datasheets\R0805_VISHAY_CRCW e3.pdf; Author: CERN DEM BR; CreateDate: 27/05/2019; LatestRevisionDate: 27/05/2019
R171 = R0402_10K_1%_0.0625W_100PPM: Resistor - 1%; Part Description: General Purpose Thick Film Chip Resistor; Manufacturer: GENERIC; Manufacturer1 Part Number: 232270671003L; TC: ±100ppm/°C; PressFit: No; Part Number: R0402_10K_1%_0.0625W_100PPM; Component Kind: Standard; Component Type: Standard; Pin Count: 2; Value: 10k; Status: Not Recommended; Power: 0.0625W; Tolerance: ±1%; Manufacturer Part Number: R0402_10K_1%_0.0625W_100PPM; Case: 0402; Mounted: Yes; Sense: No; Socket: No; SMD: Yes; Manufacturer1 Example: YAGEO PHYCOMP; Manufacturer1 ComponentHeight: 0.4mm; HelpURL: \\cern.ch\dfs\Applications\Altium\Datasheets\R0402_Phycomp_RC0402.pdf; Author: CERN DEM JLC; CreateDate: 2007-12-03; LatestRevisionDate: 2012-10-17
ST1 = SCHROFF_PANEL_3U_4HP: Schroff 3HP 4U EUROCARD Panel Kit; Manufacturer Part Number: 20818-017; Manufacturer: Schroff
TP2 TP6 TP7 TP11 TP12 TP20 TP21 TP25-TP29 TP31-TP34 = SMD_PAD_1.27X1.27MM: Part Description: 1.27mm x 1.27mm PCB Copper Area (SMD Test Point); Mounted: No; Part Number: SMD_PAD_1.27X1.27MM; Component Kind: Standard (No BOM); Component Type: Standard (No BOM); Pin Count: 1; Family: Test Point; Socket: No; SMD: Yes; Sense: No; Status: None; ComponentHeight: 0mm; HelpURL: Undefined; Author: CERN DEM JLC; CreateDate: 12.01.2008; LatestRevisionDate: 12.01.2008; PackageDescription: 1.27mm x 1.27mm PCB Copper Area (SMD Test Point)
TP13 = NICOMATIC_C12000B: Part Description: SMD Test Point; PressFit: No; Status Comment: Sourcing Difficulties; Part Number: NICOMATIC_C12000B; Component Kind: Standard; Component Type: Standard; Pin Count: 1; Family: Test Point; Mounted: Yes; Socket: No; SMD: Yes; Sense: No; Status: Not Recommended; Manufacturer: NICOMATIC; Manufacturer Part Number: C12000B; ComponentHeight: 1.5mm; HelpURL: \\cern.ch\dfs\Applications\Altium\Datasheets\NICOMATIC_C12000B.pdf; Author: CERN DEM JLC; CreateDate: 25.03.2009; LatestRevisionDate: 10.08.2017
WASHER1 WASHER2 = Keystone_7687: SMA_Shoulder Washer; Part Description: Polyphenylene Sulfide PPS Shoulder Washer; PressFit: No; Part Number: Custom 3D printed; Component Kind: Standard; Component Type: Mechanical; Footprint: Custom 3D printed; Pin Count: 0; PackageDescription: Polyphenylene Sulfide PPS Shoulder Washer; Mounted: Yes; Socket: No; SMD: No; Sense: No; Status: None; Value: Custom 3D printed; Manufacturer: Custom 3D printed; Manufacturer Part Number: Custom 3D printed; ComponentHeight: 1.91mm; HelpURL: \\cern.ch\dfs\Applications\Altium\Datasheets\AAVID-THERMALLOY_7721-7PPSG.pdf; Author: GK; CreateDate: 28.01.2016; LatestRevisionDate: 28.01.2016